# EAGLE schematic sd2snes17 (EAGLE 4.15)

## Sheet 1 of 4
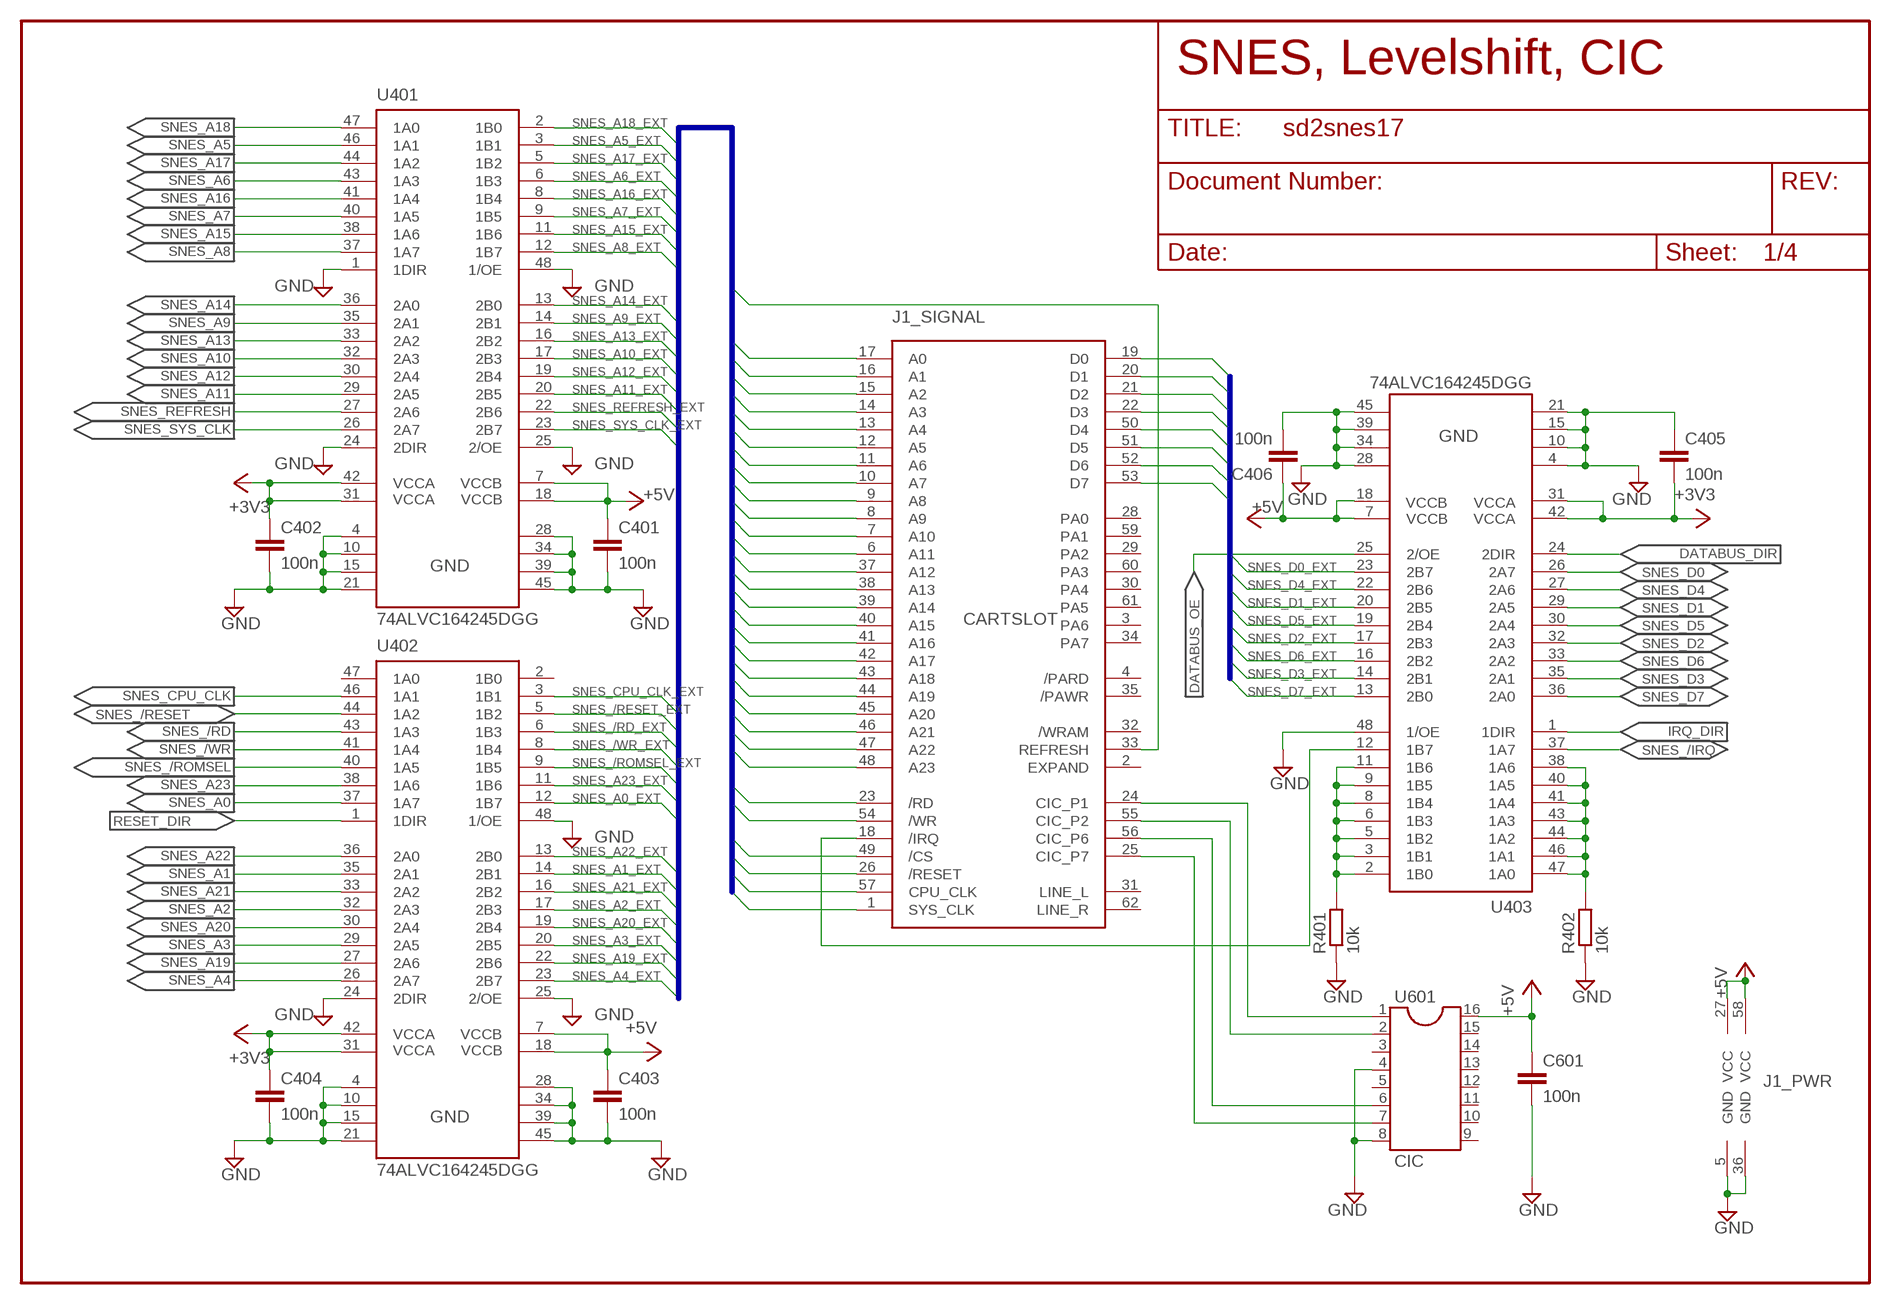
[diagram p0: schematic, sheet 1]

### Parts
C401  100n  C-EUC0805  [C0805]
C402  100n  C-EUC0805  [C0805]
C403  100n  C-EUC0805  [C0805]
C404  100n  C-EUC0805  [C0805]
C405  100n  C-EUC0805  [C0805]
C406  100n  C-EUC0805  [C0805]
C601  100n  C-EUC0805  [C0805]
J1  CARTSLOT  SNESCARTEDGE  [SNESCART]
R401  10k  R-EU_R0805  [R0805]
R402  10k  R-EU_R0805  [R0805]
U401  74ALVC164245DGG  [TSSOP48]
U402  74ALVC164245DGG  [TSSOP48]
U403  74ALVC164245DGG  [TSSOP48]
U601  CIC  DIL16S  [SOCKED-16]

### Nets
+3V3: C402.1 C404.1 C405.2 U401.31(VCCA1) U401.42(VCCA) U402.31(VCCA1) U402.42(VCCA) U403.31(VCCA1) U403.42(VCCA) ; also sheet 2,3,4
+5V: C401.1 C403.1 C406.1 C601.1 J1.27(_PWR:VCC) J1.58(_PWR:VCC) U401.7(VCCB) U401.18(VCCB1) U402.7(VCCB) U402.18(VCCB1) U403.7(VCCB) U403.18(VCCB1) U601.16 ; also sheet 4
GND: C401.2 C402.2 C403.2 C404.2 C405.1 C406.2 C601.2 J1.5(_PWR:GND) J1.36(_PWR:GND) R401.1 R402.1 U401.1(1DIR) U401.4(GND) U401.10(GND) U401.15(GND) U401.21(GND) U401.24(2DIR) U401.25(2/OE) U401.28(GND) U401.34(GND) U401.39(GND) U401.45(GND) U401.48(1/OE) U402.4(GND) U402.10(GND) U402.15(GND) U402.21(GND) U402.24(2DIR) U402.25(2/OE) U402.28(GND) U402.34(GND) U402.39(GND) U402.45(GND) U402.48(1/OE) U403.4(GND) U403.10(GND) U403.15(GND) U403.21(GND) U403.28(GND) U403.34(GND) U403.39(GND) U403.45(GND) U403.48(1/OE) U601.4 U601.8 ; also sheet 2,3,4
IRQ_DIR: U403.1(1DIR) ; also sheet 2
N$1: J1.24(_SIGNAL:CIC_P1) U601.1
N$2: J1.55(_SIGNAL:CIC_P2) U601.2
N$3: J1.56(_SIGNAL:CIC_P6) U601.6
N$4: J1.25(_SIGNAL:CIC_P7) U601.7
N$10: R401.2 U403.2(1B0) U403.3(1B1) U403.5(1B2) U403.6(1B3) U403.8(1B4) U403.9(1B5) U403.11(1B6)
N$12: R402.2 U403.38(1A6) U403.40(1A5) U403.41(1A4) U403.43(1A3) U403.44(1A2) U403.46(1A1) U403.47(1A0)
RESET_DIR: U402.1(1DIR) ; also sheet 4
SNES_/IRQ: U403.37(1A7) ; also sheet 2
SNES_/IRQ_EXT: J1.18(_SIGNAL:/IRQ) U403.12(1B7)
SNES_/RD: U402.43(1A3) ; also sheet 2
SNES_/RD_EXT: J1.23(_SIGNAL:/RD) U402.6(1B3)
SNES_/RESET: U402.44(1A2) ; also sheet 4
SNES_/RESET_EXT: J1.26(_SIGNAL:/RESET) U402.5(1B2)
SNES_/ROMSEL: U402.40(1A5) ; also sheet 2
SNES_/ROMSEL_EXT: J1.49(_SIGNAL:/CS) U402.9(1B5)
SNES_/WR: U402.41(1A4) ; also sheet 2
SNES_/WR_EXT: J1.54(_SIGNAL:/WR) U402.8(1B4)
SNES_A0: U402.37(1A7) ; also sheet 2
SNES_A0_EXT: J1.17(_SIGNAL:A0) U402.12(1B7)
SNES_A1: U402.35(2A1) ; also sheet 2
SNES_A1_EXT: J1.16(_SIGNAL:A1) U402.14(2B1)
SNES_A2: U402.32(2A3) ; also sheet 2
SNES_A2_EXT: J1.15(_SIGNAL:A2) U402.17(2B3)
SNES_A3: U402.29(2A5) ; also sheet 2
SNES_A3_EXT: J1.14(_SIGNAL:A3) U402.20(2B5)
SNES_A4: U402.26(2A7) ; also sheet 2
SNES_A4_EXT: J1.13(_SIGNAL:A4) U402.23(2B7)
SNES_A5: U401.46(1A1) ; also sheet 2
SNES_A5_EXT: J1.12(_SIGNAL:A5) U401.3(1B1)
SNES_A6: U401.43(1A3) ; also sheet 2
SNES_A6_EXT: J1.11(_SIGNAL:A6) U401.6(1B3)
SNES_A7: U401.40(1A5) ; also sheet 2
SNES_A7_EXT: J1.10(_SIGNAL:A7) U401.9(1B5)
SNES_A8: U401.37(1A7) ; also sheet 2
SNES_A8_EXT: J1.9(_SIGNAL:A8) U401.12(1B7)
SNES_A9: U401.35(2A1) ; also sheet 2
SNES_A9_EXT: J1.8(_SIGNAL:A9) U401.14(2B1)
SNES_A10: U401.32(2A3) ; also sheet 2
SNES_A10_EXT: J1.7(_SIGNAL:A10) U401.17(2B3)
SNES_A11: U401.29(2A5) ; also sheet 2
SNES_A11_EXT: J1.6(_SIGNAL:A11) U401.20(2B5)
SNES_A12: U401.30(2A4) ; also sheet 2
SNES_A12_EXT: J1.37(_SIGNAL:A12) U401.19(2B4)
SNES_A13: U401.33(2A2) ; also sheet 2
SNES_A13_EXT: J1.38(_SIGNAL:A13) U401.16(2B2)
SNES_A14: U401.36(2A0) ; also sheet 2
SNES_A14_EXT: J1.39(_SIGNAL:A14) U401.13(2B0)
SNES_A15: U401.38(1A6) ; also sheet 2
SNES_A15_EXT: J1.40(_SIGNAL:A15) U401.11(1B6)
SNES_A16: U401.41(1A4) ; also sheet 2
SNES_A16_EXT: J1.41(_SIGNAL:A16) U401.8(1B4)
SNES_A17: U401.44(1A2) ; also sheet 2
SNES_A17_EXT: J1.42(_SIGNAL:A17) U401.5(1B2)
SNES_A18: U401.47(1A0) ; also sheet 2
SNES_A18_EXT: J1.43(_SIGNAL:A18) U401.2(1B0)
SNES_A19: U402.27(2A6) ; also sheet 2
SNES_A19_EXT: J1.44(_SIGNAL:A19) U402.22(2B6)
SNES_A20: U402.30(2A4) ; also sheet 2
SNES_A20_EXT: J1.45(_SIGNAL:A20) U402.19(2B4)
SNES_A21: U402.33(2A2) ; also sheet 2
SNES_A21_EXT: J1.46(_SIGNAL:A21) U402.16(2B2)
SNES_A22: U402.36(2A0) ; also sheet 2
SNES_A22_EXT: J1.47(_SIGNAL:A22) U402.13(2B0)
SNES_A23: U402.38(1A6) ; also sheet 2
SNES_A23_EXT: J1.48(_SIGNAL:A23) U402.11(1B6)
SNES_CPU_CLK: U402.46(1A1) ; also sheet 2
SNES_CPU_CLK_EXT: J1.57(_SIGNAL:CPU_CLK) U402.3(1B1)
SNES_D0: U403.26(2A7) ; also sheet 2
SNES_D0_EXT: J1.19(_SIGNAL:D0) U403.23(2B7)
SNES_D1: U403.29(2A5) ; also sheet 2
SNES_D1_EXT: J1.20(_SIGNAL:D1) U403.20(2B5)
SNES_D2: U403.32(2A3) ; also sheet 2
SNES_D2_EXT: J1.21(_SIGNAL:D2) U403.17(2B3)
SNES_D3: U403.35(2A1) ; also sheet 2
SNES_D3_EXT: J1.22(_SIGNAL:D3) U403.14(2B1)
SNES_D4: U403.27(2A6) ; also sheet 2
SNES_D4_EXT: J1.50(_SIGNAL:D4) U403.22(2B6)
SNES_D5: U403.30(2A4) ; also sheet 2
SNES_D5_EXT: J1.51(_SIGNAL:D5) U403.19(2B4)
SNES_D6: U403.33(2A2) ; also sheet 2
SNES_D6_EXT: J1.52(_SIGNAL:D6) U403.16(2B2)
SNES_D7: U403.36(2A0) ; also sheet 2
SNES_D7_EXT: J1.53(_SIGNAL:D7) U403.13(2B0)
SNES_DATABUS_/OE: U403.25(2/OE) ; also sheet 2
SNES_DATABUS_DIR: U403.24(2DIR) ; also sheet 2
SNES_REFRESH: U401.27(2A6) ; also sheet 2
SNES_REFRESH_EXT: J1.33(_SIGNAL:REFRESH) U401.22(2B6)
SNES_SYS_CLK: U401.26(2A7) ; also sheet 2
SNES_SYS_CLK_EXT: J1.1(_SIGNAL:SYS_CLK) U401.23(2B7)
Unconnected: J1.2(_SIGNAL:EXPAND) J1.3(_SIGNAL:PA6) J1.4(_SIGNAL:/PARD) J1.28(_SIGNAL:PA0) J1.29(_SIGNAL:PA2) J1.30(_SIGNAL:PA4) J1.31(_SIGNAL:LINE_L) J1.32(_SIGNAL:/WRAM) J1.34(_SIGNAL:PA7) J1.35(_SIGNAL:/PAWR) J1.59(_SIGNAL:PA1) J1.60(_SIGNAL:PA3) J1.61(_SIGNAL:PA5) J1.62(_SIGNAL:LINE_R) U402.2(1B0) U402.47(1A0) U601.3 U601.5 U601.9 U601.10 U601.11 U601.12 U601.13 U601.14 U601.15

### Buses
B$1
B$2

### Notes on the sheet
- SNES, Levelshift, CIC

## Sheet 2 of 4
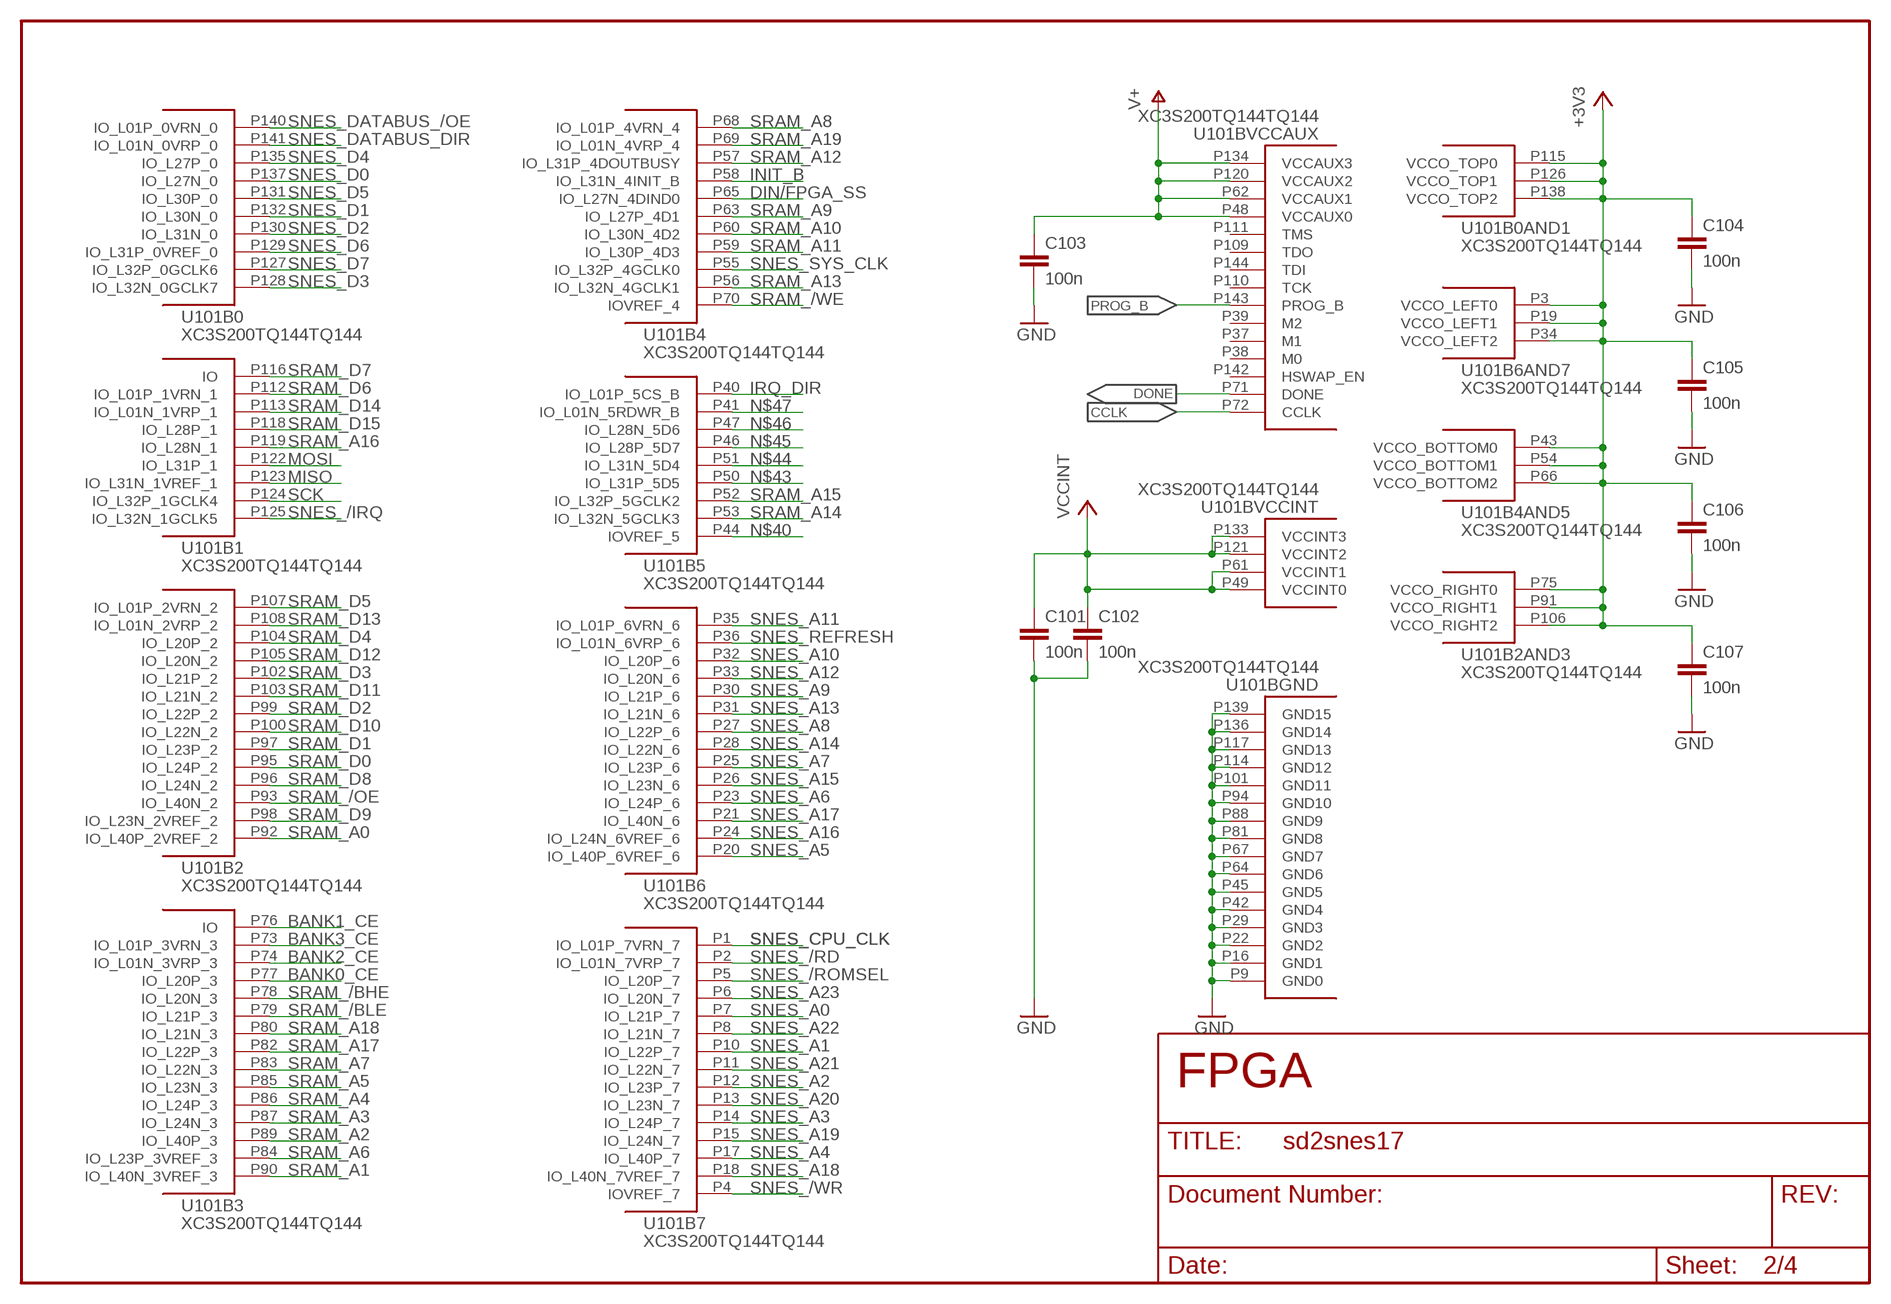
[diagram p1: schematic, sheet 2]

### Parts
C101  100n  C-EUC0805  [C0805]
C102  100n  C-EUC0805  [C0805]
C103  100n  C-EUC0805  [C0805]
C104  100n  C-EUC0805  [C0805]
C105  100n  C-EUC0805  [C0805]
C106  100n  C-EUC0805  [C0805]
C107  100n  C-EUC0805  [C0805]
U101  XC3S200TQ144TQ144  [TQ144]

### Nets
+1.25V: C101.1 C102.1 U101.P49(BVCCINT:VCCINT0) U101.P61(BVCCINT:VCCINT1) U101.P121(BVCCINT:VCCINT2) U101.P133(BVCCINT:VCCINT3) ; supply symbol labelled VCCINT ; also sheet 4
+2.5V: C103.1 U101.P48(BVCCAUX:VCCAUX0) U101.P62(BVCCAUX:VCCAUX1) U101.P120(BVCCAUX:VCCAUX2) U101.P134(BVCCAUX:VCCAUX3) ; supply symbol labelled V+ ; also sheet 4
+3V3: C104.1 C105.1 C106.1 C107.1 U101.P3(B6AND7:VCCO_LEFT0) U101.P19(B6AND7:VCCO_LEFT1) U101.P34(B6AND7:VCCO_LEFT2) U101.P43(B4AND5:VCCO_BOTTOM0) U101.P54(B4AND5:VCCO_BOTTOM1) U101.P66(B4AND5:VCCO_BOTTOM2) U101.P75(B2AND3:VCCO_RIGHT0) U101.P91(B2AND3:VCCO_RIGHT1) U101.P106(B2AND3:VCCO_RIGHT2) U101.P115(B0AND1:VCCO_TOP0) U101.P126(B0AND1:VCCO_TOP1) U101.P138(B0AND1:VCCO_TOP2) ; also sheet 1,3,4
BANK0_CE: U101.P77(B3:IO_L20P_3) ; also sheet 3
BANK1_CE: U101.P76(B3:IO) ; also sheet 3
BANK2_CE: U101.P74(B3:IO_L01N_3VRP_3) ; also sheet 3
BANK3_CE: U101.P73(B3:IO_L01P_3VRN_3) ; also sheet 3
CCLK: U101.P72(BVCCAUX:CCLK) ; also sheet 4
DIN/FPGA_SS: U101.P65(B4:IO_L27N_4DIND0) ; also sheet 4
DONE: U101.P71(BVCCAUX:DONE)
GND: C101.2 C102.2 C103.2 C104.2 C105.2 C106.2 C107.2 U101.P9(BGND:GND0) U101.P16(BGND:GND1) U101.P22(BGND:GND2) U101.P29(BGND:GND3) U101.P42(BGND:GND4) U101.P45(BGND:GND5) U101.P64(BGND:GND6) U101.P67(BGND:GND7) U101.P81(BGND:GND8) U101.P88(BGND:GND9) U101.P94(BGND:GND10) U101.P101(BGND:GND11) U101.P114(BGND:GND12) U101.P117(BGND:GND13) U101.P136(BGND:GND14) U101.P139(BGND:GND15) ; also sheet 1,3,4
INIT_B: U101.P58(B4:IO_L31N_4INIT_B) ; also sheet 4
IRQ_DIR: U101.P40(B5:IO_L01P_5CS_B) ; also sheet 1
MISO: U101.P123(B1:IO_L31N_1VREF_1) ; also sheet 4
MOSI: U101.P122(B1:IO_L31P_1) ; also sheet 4
N$40: U101.P44(B5:IOVREF_5)
N$43: U101.P50(B5:IO_L31P_5D5)
N$44: U101.P51(B5:IO_L31N_5D4)
N$45: U101.P46(B5:IO_L28P_5D7)
N$46: U101.P47(B5:IO_L28N_5D6)
N$47: U101.P41(B5:IO_L01N_5RDWR_B)
PROG_B: U101.P143(BVCCAUX:PROG_B) ; also sheet 4
SCK: U101.P124(B1:IO_L32P_1GCLK4) ; also sheet 4
SNES_/IRQ: U101.P125(B1:IO_L32N_1GCLK5) ; also sheet 1
SNES_/RD: U101.P2(B7:IO_L01N_7VRP_7) ; also sheet 1
SNES_/ROMSEL: U101.P5(B7:IO_L20P_7) ; also sheet 1
SNES_/WR: U101.P4(B7:IOVREF_7) ; also sheet 1
SNES_A0: U101.P7(B7:IO_L21P_7) ; also sheet 1
SNES_A1: U101.P10(B7:IO_L22P_7) ; also sheet 1
SNES_A2: U101.P12(B7:IO_L23P_7) ; also sheet 1
SNES_A3: U101.P14(B7:IO_L24P_7) ; also sheet 1
SNES_A4: U101.P17(B7:IO_L40P_7) ; also sheet 1
SNES_A5: U101.P20(B6:IO_L40P_6VREF_6) ; also sheet 1
SNES_A6: U101.P23(B6:IO_L24P_6) ; also sheet 1
SNES_A7: U101.P25(B6:IO_L23P_6) ; also sheet 1
SNES_A8: U101.P27(B6:IO_L22P_6) ; also sheet 1
SNES_A9: U101.P30(B6:IO_L21P_6) ; also sheet 1
SNES_A10: U101.P32(B6:IO_L20P_6) ; also sheet 1
SNES_A11: U101.P35(B6:IO_L01P_6VRN_6) ; also sheet 1
SNES_A12: U101.P33(B6:IO_L20N_6) ; also sheet 1
SNES_A13: U101.P31(B6:IO_L21N_6) ; also sheet 1
SNES_A14: U101.P28(B6:IO_L22N_6) ; also sheet 1
SNES_A15: U101.P26(B6:IO_L23N_6) ; also sheet 1
SNES_A16: U101.P24(B6:IO_L24N_6VREF_6) ; also sheet 1
SNES_A17: U101.P21(B6:IO_L40N_6) ; also sheet 1
SNES_A18: U101.P18(B7:IO_L40N_7VREF_7) ; also sheet 1
SNES_A19: U101.P15(B7:IO_L24N_7) ; also sheet 1
SNES_A20: U101.P13(B7:IO_L23N_7) ; also sheet 1
SNES_A21: U101.P11(B7:IO_L22N_7) ; also sheet 1
SNES_A22: U101.P8(B7:IO_L21N_7) ; also sheet 1
SNES_A23: U101.P6(B7:IO_L20N_7) ; also sheet 1
SNES_CPU_CLK: U101.P1(B7:IO_L01P_7VRN_7) ; also sheet 1
SNES_D0: U101.P137(B0:IO_L27N_0) ; also sheet 1
SNES_D1: U101.P132(B0:IO_L30N_0) ; also sheet 1
SNES_D2: U101.P130(B0:IO_L31N_0) ; also sheet 1
SNES_D3: U101.P128(B0:IO_L32N_0GCLK7) ; also sheet 1
SNES_D4: U101.P135(B0:IO_L27P_0) ; also sheet 1
SNES_D5: U101.P131(B0:IO_L30P_0) ; also sheet 1
SNES_D6: U101.P129(B0:IO_L31P_0VREF_0) ; also sheet 1
SNES_D7: U101.P127(B0:IO_L32P_0GCLK6) ; also sheet 1
SNES_DATABUS_/OE: U101.P140(B0:IO_L01P_0VRN_0) ; also sheet 1
SNES_DATABUS_DIR: U101.P141(B0:IO_L01N_0VRP_0) ; also sheet 1
SNES_REFRESH: U101.P36(B6:IO_L01N_6VRP_6) ; also sheet 1
SNES_SYS_CLK: U101.P55(B4:IO_L32P_4GCLK0) ; also sheet 1
SRAM_/BHE: U101.P78(B3:IO_L20N_3) ; also sheet 3
SRAM_/BLE: U101.P79(B3:IO_L21P_3) ; also sheet 3
SRAM_/OE: U101.P93(B2:IO_L40N_2) ; also sheet 3
SRAM_/WE: U101.P70(B4:IOVREF_4) ; also sheet 3
SRAM_A0: U101.P92(B2:IO_L40P_2VREF_2) ; also sheet 3
SRAM_A1: U101.P90(B3:IO_L40N_3VREF_3) ; also sheet 3
SRAM_A2: U101.P89(B3:IO_L40P_3) ; also sheet 3
SRAM_A3: U101.P87(B3:IO_L24N_3) ; also sheet 3
SRAM_A4: U101.P86(B3:IO_L24P_3) ; also sheet 3
SRAM_A5: U101.P85(B3:IO_L23N_3) ; also sheet 3
SRAM_A6: U101.P84(B3:IO_L23P_3VREF_3) ; also sheet 3
SRAM_A7: U101.P83(B3:IO_L22N_3) ; also sheet 3
SRAM_A8: U101.P68(B4:IO_L01P_4VRN_4) ; also sheet 3
SRAM_A9: U101.P63(B4:IO_L27P_4D1) ; also sheet 3
SRAM_A10: U101.P60(B4:IO_L30N_4D2) ; also sheet 3
SRAM_A11: U101.P59(B4:IO_L30P_4D3) ; also sheet 3
SRAM_A12: U101.P57(B4:IO_L31P_4DOUTBUSY) ; also sheet 3
SRAM_A13: U101.P56(B4:IO_L32N_4GCLK1) ; also sheet 3
SRAM_A14: U101.P53(B5:IO_L32N_5GCLK3) ; also sheet 3
SRAM_A15: U101.P52(B5:IO_L32P_5GCLK2) ; also sheet 3
SRAM_A16: U101.P119(B1:IO_L28N_1) ; also sheet 3
SRAM_A17: U101.P82(B3:IO_L22P_3) ; also sheet 3
SRAM_A18: U101.P80(B3:IO_L21N_3) ; also sheet 3
SRAM_A19: U101.P69(B4:IO_L01N_4VRP_4) ; also sheet 3
SRAM_D0: U101.P95(B2:IO_L24P_2) ; also sheet 3
SRAM_D1: U101.P97(B2:IO_L23P_2) ; also sheet 3
SRAM_D2: U101.P99(B2:IO_L22P_2) ; also sheet 3
SRAM_D3: U101.P102(B2:IO_L21P_2) ; also sheet 3
SRAM_D4: U101.P104(B2:IO_L20P_2) ; also sheet 3
SRAM_D5: U101.P107(B2:IO_L01P_2VRN_2) ; also sheet 3
SRAM_D6: U101.P112(B1:IO_L01P_1VRN_1) ; also sheet 3
SRAM_D7: U101.P116(B1:IO) ; also sheet 3
SRAM_D8: U101.P96(B2:IO_L24N_2) ; also sheet 3
SRAM_D9: U101.P98(B2:IO_L23N_2VREF_2) ; also sheet 3
SRAM_D10: U101.P100(B2:IO_L22N_2) ; also sheet 3
SRAM_D11: U101.P103(B2:IO_L21N_2) ; also sheet 3
SRAM_D12: U101.P105(B2:IO_L20N_2) ; also sheet 3
SRAM_D13: U101.P108(B2:IO_L01N_2VRP_2) ; also sheet 3
SRAM_D14: U101.P113(B1:IO_L01N_1VRP_1) ; also sheet 3
SRAM_D15: U101.P118(B1:IO_L28P_1) ; also sheet 3
Unconnected: U101.P37(BVCCAUX:M1) U101.P38(BVCCAUX:M0) U101.P39(BVCCAUX:M2) U101.P109(BVCCAUX:TDO) U101.P110(BVCCAUX:TCK) U101.P111(BVCCAUX:TMS) U101.P142(BVCCAUX:HSWAP_EN) U101.P144(BVCCAUX:TDI)

### Notes on the sheet
- FPGA

## Sheet 3 of 4
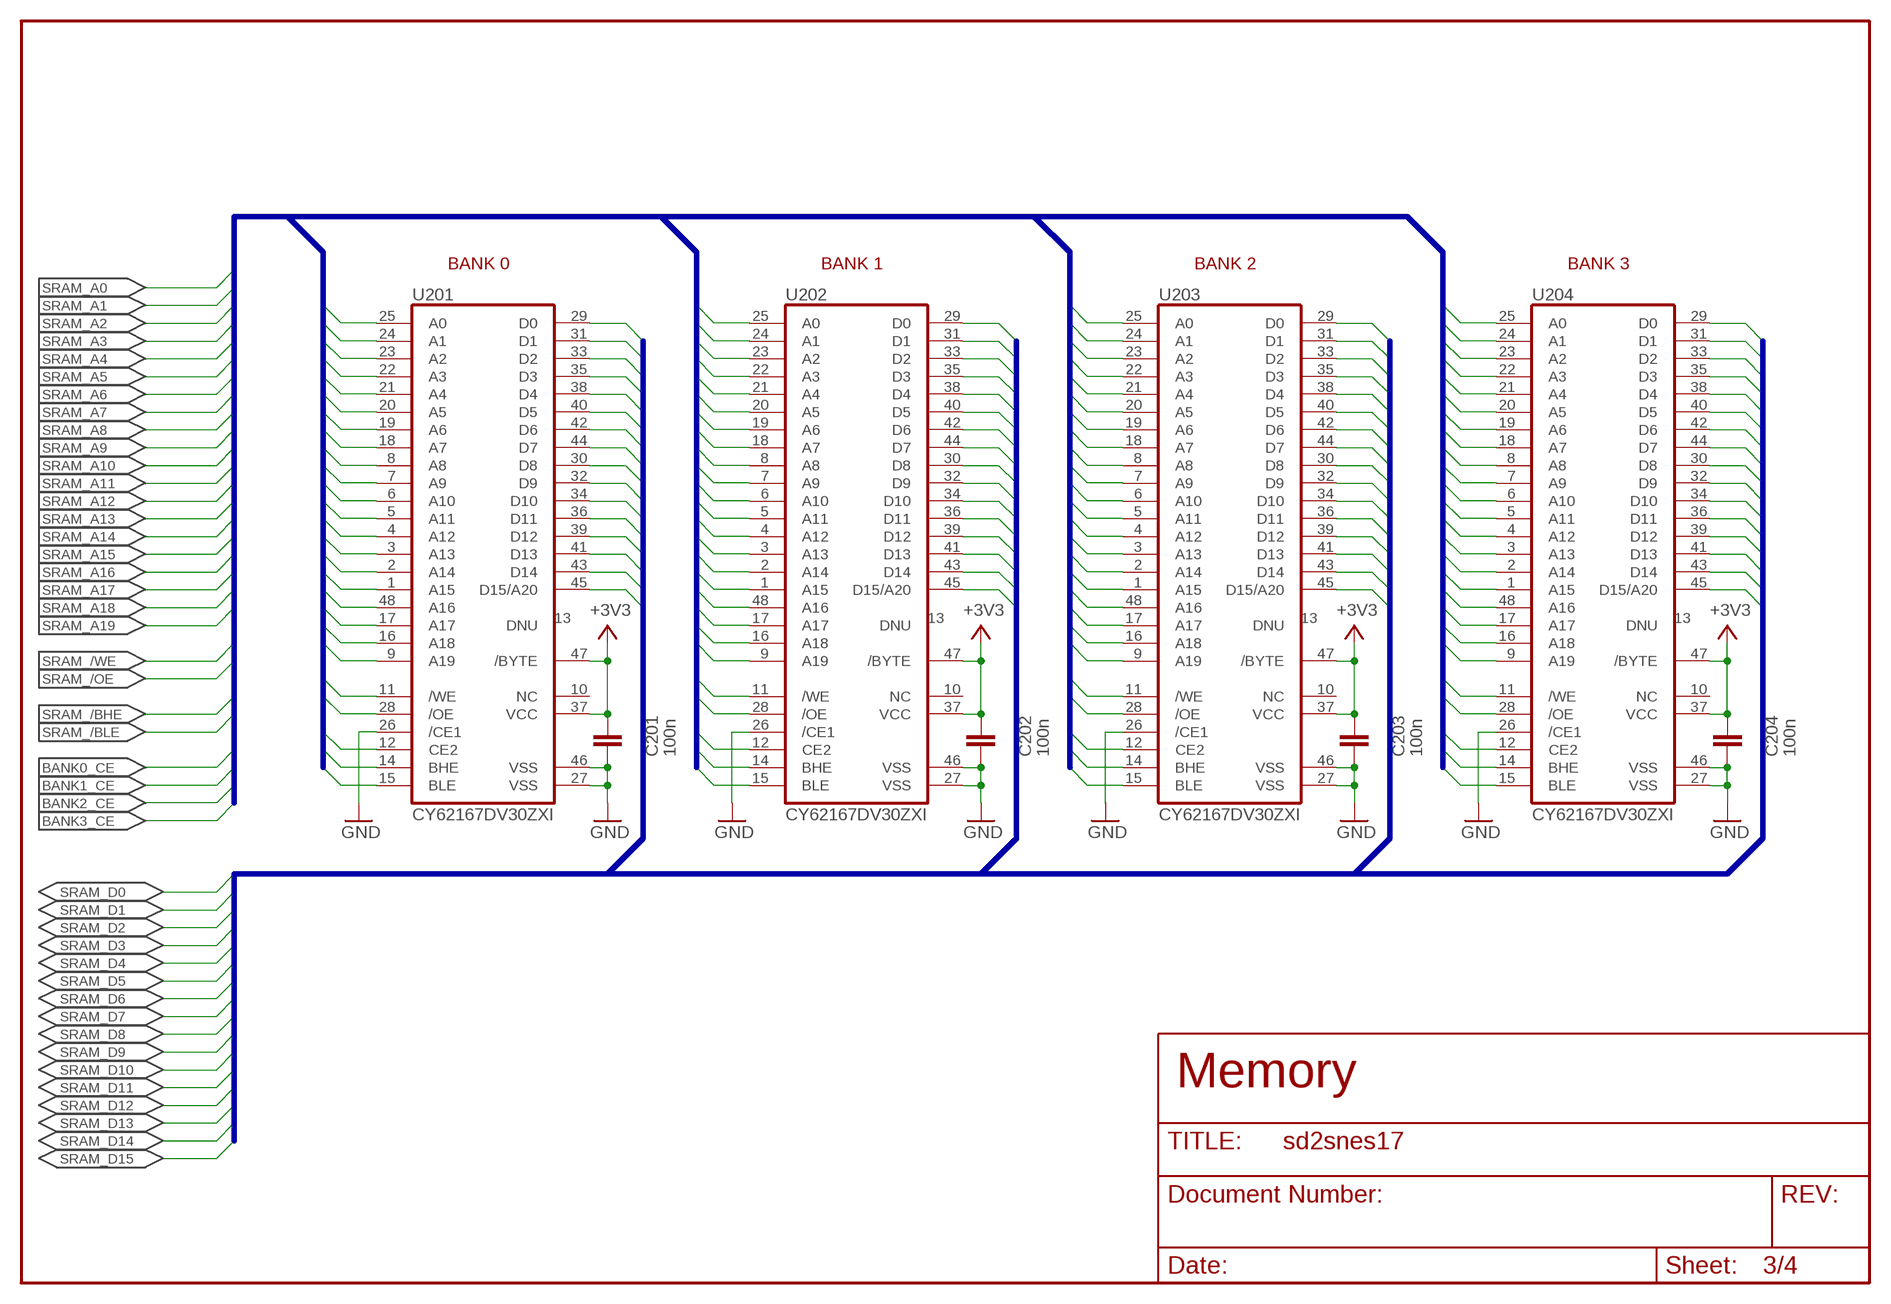
[diagram p2: schematic, sheet 3]

### Parts
C201  100n  C-EUC0805  [C0805]
C202  100n  C-EUC0805  [C0805]
C203  100n  C-EUC0805  [C0805]
C204  100n  C-EUC0805  [C0805]
U201  CY62167DV30ZXI  [TSOP48]
U202  CY62167DV30ZXI  [TSOP48]
U203  CY62167DV30ZXI  [TSOP48]
U204  CY62167DV30ZXI  [TSOP48]

### Nets
+3V3: C201.1 C202.1 C203.1 C204.1 U201.37(VCC) U201.47(/BYTE) U202.37(VCC) U202.47(/BYTE) U203.37(VCC) U203.47(/BYTE) U204.37(VCC) U204.47(/BYTE) ; also sheet 1,2,4
BANK0_CE: U201.12(CE2) ; also sheet 2
BANK1_CE: U202.12(CE2) ; also sheet 2
BANK2_CE: U203.12(CE2) ; also sheet 2
BANK3_CE: U204.12(CE2) ; also sheet 2
GND: C201.2 C202.2 C203.2 C204.2 U201.26(/CE1) U201.27(VSS) U201.46(VSS) U202.26(/CE1) U202.27(VSS) U202.46(VSS) U203.26(/CE1) U203.27(VSS) U203.46(VSS) U204.26(/CE1) U204.27(VSS) U204.46(VSS) ; also sheet 1,2,4
SRAM_/BHE: U201.14(BHE) U202.14(BHE) U203.14(BHE) U204.14(BHE) ; also sheet 2
SRAM_/BLE: U201.15(BLE) U202.15(BLE) U203.15(BLE) U204.15(BLE) ; also sheet 2
SRAM_/OE: U201.28(/OE) U202.28(/OE) U203.28(/OE) U204.28(/OE) ; also sheet 2
SRAM_/WE: U201.11(/WE) U202.11(/WE) U203.11(/WE) U204.11(/WE) ; also sheet 2
SRAM_A0: U201.25(A0) U202.25(A0) U203.25(A0) U204.25(A0) ; also sheet 2
SRAM_A1: U201.24(A1) U202.24(A1) U203.24(A1) U204.24(A1) ; also sheet 2
SRAM_A2: U201.23(A2) U202.23(A2) U203.23(A2) U204.23(A2) ; also sheet 2
SRAM_A3: U201.22(A3) U202.22(A3) U203.22(A3) U204.22(A3) ; also sheet 2
SRAM_A4: U201.21(A4) U202.21(A4) U203.21(A4) U204.21(A4) ; also sheet 2
SRAM_A5: U201.20(A5) U202.20(A5) U203.20(A5) U204.20(A5) ; also sheet 2
SRAM_A6: U201.19(A6) U202.19(A6) U203.19(A6) U204.19(A6) ; also sheet 2
SRAM_A7: U201.18(A7) U202.18(A7) U203.18(A7) U204.18(A7) ; also sheet 2
SRAM_A8: U201.8(A8) U202.8(A8) U203.8(A8) U204.8(A8) ; also sheet 2
SRAM_A9: U201.7(A9) U202.7(A9) U203.7(A9) U204.7(A9) ; also sheet 2
SRAM_A10: U201.6(A10) U202.6(A10) U203.6(A10) U204.6(A10) ; also sheet 2
SRAM_A11: U201.5(A11) U202.5(A11) U203.5(A11) U204.5(A11) ; also sheet 2
SRAM_A12: U201.4(A12) U202.4(A12) U203.4(A12) U204.4(A12) ; also sheet 2
SRAM_A13: U201.3(A13) U202.3(A13) U203.3(A13) U204.3(A13) ; also sheet 2
SRAM_A14: U201.2(A14) U202.2(A14) U203.2(A14) U204.2(A14) ; also sheet 2
SRAM_A15: U201.1(A15) U202.1(A15) U203.1(A15) U204.1(A15) ; also sheet 2
SRAM_A16: U201.48(A16) U202.48(A16) U203.48(A16) U204.48(A16) ; also sheet 2
SRAM_A17: U201.17(A17) U202.17(A17) U203.17(A17) U204.17(A17) ; also sheet 2
SRAM_A18: U201.16(A18) U202.16(A18) U203.16(A18) U204.16(A18) ; also sheet 2
SRAM_A19: U201.9(A19) U202.9(A19) U203.9(A19) U204.9(A19) ; also sheet 2
SRAM_D0: U201.29(D0) U202.29(D0) U203.29(D0) U204.29(D0) ; also sheet 2
SRAM_D1: U201.31(D1) U202.31(D1) U203.31(D1) U204.31(D1) ; also sheet 2
SRAM_D2: U201.33(D2) U202.33(D2) U203.33(D2) U204.33(D2) ; also sheet 2
SRAM_D3: U201.35(D3) U202.35(D3) U203.35(D3) U204.35(D3) ; also sheet 2
SRAM_D4: U201.38(D4) U202.38(D4) U203.38(D4) U204.38(D4) ; also sheet 2
SRAM_D5: U201.40(D5) U202.40(D5) U203.40(D5) U204.40(D5) ; also sheet 2
SRAM_D6: U201.42(D6) U202.42(D6) U203.42(D6) U204.42(D6) ; also sheet 2
SRAM_D7: U201.44(D7) U202.44(D7) U203.44(D7) U204.44(D7) ; also sheet 2
SRAM_D8: U201.30(D8) U202.30(D8) U203.30(D8) U204.30(D8) ; also sheet 2
SRAM_D9: U201.32(D9) U202.32(D9) U203.32(D9) U204.32(D9) ; also sheet 2
SRAM_D10: U201.34(D10) U202.34(D10) U203.34(D10) U204.34(D10) ; also sheet 2
SRAM_D11: U201.36(D11) U202.36(D11) U203.36(D11) U204.36(D11) ; also sheet 2
SRAM_D12: U201.39(D12) U202.39(D12) U203.39(D12) U204.39(D12) ; also sheet 2
SRAM_D13: U201.41(D13) U202.41(D13) U203.41(D13) U204.41(D13) ; also sheet 2
SRAM_D14: U201.43(D14) U202.43(D14) U203.43(D14) U204.43(D14) ; also sheet 2
SRAM_D15: U201.45(D15/A20) U202.45(D15/A20) U203.45(D15/A20) U204.45(D15/A20) ; also sheet 2
Unconnected: U201.10(NC) U201.13(DNU) U202.10(NC) U202.13(DNU) U203.10(NC) U203.13(DNU) U204.10(NC) U204.13(DNU)

### Buses
B$3
B$4

### Notes on the sheet
- BANK 0 | BANK 1 | BANK 2 | BANK 3
- Memory

## Sheet 4 of 4
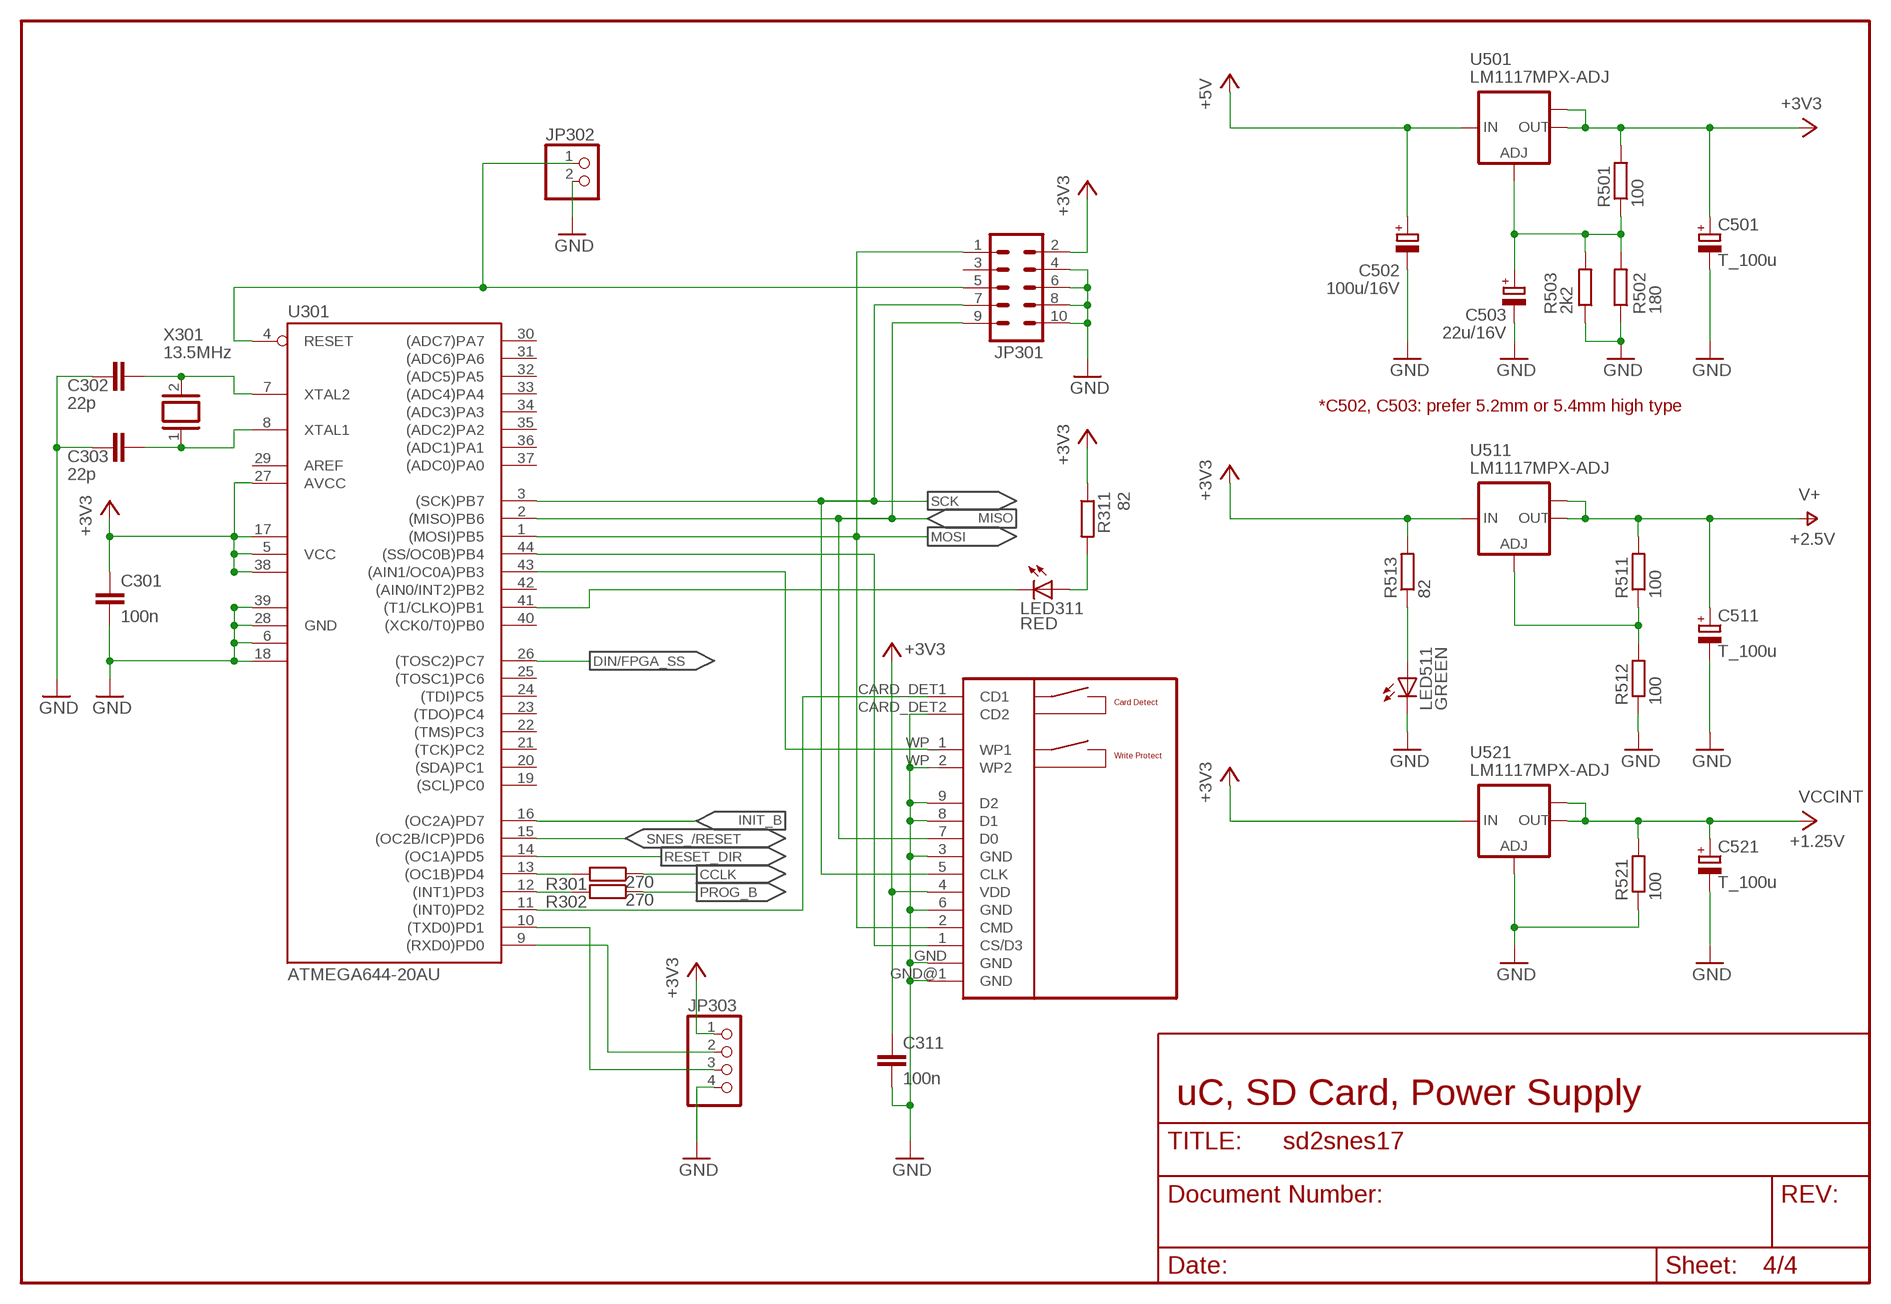
[diagram p3: schematic, sheet 4]

### Parts
C301  100n  C-EUC0805  [C0805]
C302  22p  C-EUC0805  [C0805]
C303  22p  C-EUC0805  [C0805]
C311  100n  C-EUC0805  [C0805]
C501  T_100u  CPOL-EUSMCD  [SMC_D]
C502  100u/16V  CPOL-EUD  [PANASONIC_D]
C503  22u/16V  CPOL-EUB  [PANASONIC_B]
C511  T_100u  CPOL-EUSMCD  [SMC_D]
C521  T_100u  CPOL-EUSMCD  [SMC_D]
J301  JAE-SG5S009V1A  [JAE-SG5S009V1A]
JP301  MA05-2  [MA05-2]
JP302  PINHD-1X2  [1X02]
JP303  PINHD-1X4  [1X04]
LED311  RED  LEDCHIPLED_0805  [CHIPLED_0805]
LED511  GREEN  LEDCHIPLED_0805  [CHIPLED_0805]
R301  270  R-EU_R0805  [R0805]
R302  270  R-EU_R0805  [R0805]
R311  82  R-EU_R0805  [R0805]
R501  100  R-EU_R0805  [R0805]
R502  180  R-EU_R0805  [R0805]
R503  2k2  R-EU_R0805  [R0805]
R511  100  R-EU_R0805  [R0805]
R512  100  R-EU_R0805  [R0805]
R513  82  R-EU_R0805  [R0805]
R521  100  R-EU_R0805  [R0805]
U301  ATMEGA644-20AU  [TQFP44]
U501  LM1117MPX-ADJ  [SOT223]
U511  LM1117MPX-ADJ  [SOT223]
U521  LM1117MPX-ADJ  [SOT223]
X301  13.5MHz  XTAL/S  [QS]

### Nets
+1.25V: C521.+ R521.2 U521.2(OUT) U521.TAB(OUT1) ; supply symbol labelled VCCINT ; also sheet 2
+2.5V: C511.+ R511.2 U511.2(OUT) U511.TAB(OUT1) ; supply symbol labelled V+ ; also sheet 2
+3V3: C301.1 C311.1 C501.+ J301.4(VDD) JP301.2 JP303.1 R311.1 R501.2 R513.2 U301.5(VCC) U301.17(VCC1) U301.27(AVCC) U301.38(VCC2) U501.2(OUT) U501.TAB(OUT1) U511.3(IN) U521.3(IN) ; also sheet 1,2,3
+5V: C502.+ U501.3(IN) ; also sheet 1
CCLK: R301.1 ; also sheet 2
CCLK_AVR: R301.2 U301.13((OC1B)PD4)
DIN/FPGA_SS: U301.26((TOSC2)PC7) ; also sheet 2
GND: C301.2 C302.1 C303.1 C311.2 C501.- C502.- C503.- C511.- C521.- J301.3(GND) J301.6(GND) J301.8(D1) J301.9(D2) J301.CARD_DET2(CD2) J301.GND J301.GND@1(GND) J301.WP_2(WP2) JP301.4 JP301.6 JP301.8 JP301.10 JP302.2 JP303.4 LED511.C R502.1 R503.1 R512.1 R521.1 U301.6(GND2) U301.18(GND3) U301.28(GND) U301.39(GND1) U521.1(ADJ) ; also sheet 1,2,3
INIT_B: U301.16((OC2A)PD7) ; also sheet 2
MISO: J301.7(D0) JP301.9 U301.2((MISO)PB6) ; also sheet 2
MOSI: J301.2(CMD) JP301.1 U301.1((MOSI)PB5) ; also sheet 2
N$5: C302.2 U301.7(XTAL2) X301.2
N$6: C303.2 U301.8(XTAL1) X301.1
N$7: LED311.A R311.2
N$8: JP301.5 JP302.1 U301.4(RESET)
N$9: LED511.A R513.1
N$11: LED311.C U301.41((T1/CLKO)PB1)
N$107: R511.1 R512.2 U511.1(ADJ)
N$108: C503.+ R501.1 R502.2 R503.2 U501.1(ADJ)
PROG_B: R302.1 ; also sheet 2
PROG_B_AVR: R302.2 U301.12((INT1)PD3)
RESET_DIR: U301.14((OC1A)PD5) ; also sheet 1
RXD: JP303.2 U301.9((RXD0)PD0)
SCK: J301.5(CLK) JP301.7 U301.3((SCK)PB7) ; also sheet 2
SD_DET: J301.CARD_DET1(CD1) U301.11((INT0)PD2)
SD_SS: J301.1(CS/D3) U301.44((SS/OC0B)PB4)
SD_WP: J301.WP_1(WP1) U301.43((AIN1/OC0A)PB3)
SNES_/RESET: U301.15((OC2B/ICP)PD6) ; also sheet 1
TXD: JP303.3 U301.10((TXD0)PD1)
Unconnected: JP301.3 U301.19((SCL)PC0) U301.20((SDA)PC1) U301.21((TCK)PC2) U301.22((TMS)PC3) U301.23((TDO)PC4) U301.24((TDI)PC5) U301.25((TOSC1)PC6) U301.30((ADC7)PA7) U301.31((ADC6)PA6) U301.32((ADC5)PA5) U301.33((ADC4)PA4) U301.34((ADC3)PA3) U301.35((ADC2)PA2) U301.36((ADC1)PA1) U301.37((ADC0)PA0) U301.40((XCK0/T0)PB0) U301.42((AIN0/INT2)PB2)

### Notes on the sheet
- *C502, C503: prefer 5.2mm or 5.4mm high type
- uC, SD Card, Power Supply

## Power pins joined to a net without a drawn wire
AREF: U301.29(AREF)

## Library data of the parts
C101-C107 C201-C204 C301-C303 C311 C401-C406 C601 = rcl:C-EU: CAPACITOR, European symbol
C501-C503 C511 C521 = rcl:CPOL-EU: POLARIZED CAPACITOR, European symbol
J1 = snescart:SNESCART
J301 = sdcard:JAE-SG5S009V1A
JP301 = con-lstb:MA05-2: PIN HEADER
JP302 = pinhead:PINHD-1X2: PIN HEADER
JP303 = pinhead:PINHD-1X4: PIN HEADER
LED311 LED511 = led:LED: LED OSRAM: - CHIPLED LG R971, LG N971, LY N971, LG Q971, LY Q971, LO R971, LY R971 LH N974, LH R974 LS Q976, LO Q976, LY Q976 LO Q996 - Hyper CHIPLED LW Q18S LB Q993, LB Q99A, LB R99A - SideLED LS A670, LO A670, LY A670, LG A670, LP A670 LB A673, LV A673, LT A673, LW A673 LH A674 LY A675 LS A676, LA A676, LO A676, LY A676, LW A676 LS A679, LY A679, LG A679 - Hyper Micro SIDELED® LS Y876, LA Y876, LO Y876, LY Y876 LT Y87S - SmartLED LW L88C, LW L88S LB L89C, LB L89S, LG L890 LS L89K, LO L89K, LY L89K LS L896, LA L896, LO L896, LY L896 - TOPLED LS T670, LO T670, LY T670, LG T670, LP T670 LSG T670, LSP T670, LSY T670, LOP T670, LYG T670 LG T671, LOG T671, LSG T671 LB T673, LV T673, LT T673, LW T673 LH T674 LS T676, LA T676, LO T676, LY T676, LB T676, LH T676, LSB T676, LW T676 LB T67C, LV T67C, LT T67C, LS T67K, LO T67K, LY T67K, LW E67C LS E67B, LA E67B, LO E67B, LY E67B, LB E67C, LV E67C, LT E67C LW T67C LS T679, LY T679, LG T679 LS T770, LO T770, LY T770, LG T770, LP T770 LB T773, LV T773, LT T773, LW T773 LH T774 LS E675, LA E675, LY E675, LS T675 LS T776, LA T776, LO T776, LY T776, LB T776 LHGB T686 LT T68C, LB T68C - Hyper Mini TOPLED® LB M676 - Mini TOPLED Santana® LG M470 LS M47K, LO M47K, LY M47K Source: http://www.osram.convergy.de/
R301 R302 R311 R401 R402 R501-R503 R511-R513 R521 = rcl:R-EU_: RESISTOR, European symbol
U101 = xilinx_spartan3_virtex4_and_5:XC3S200TQ144: Xilinx FPGA
U201-U204 = cy62167:CY62167DV30
U301 = atmega644:ATMEGA644-20AU
U401-U403 = misc-74:74ALVC164245
U501 U511 U521 = lm1117:LM1117MPX-ADJ
U601 = ic-package:DIL16: Dual In Line
X301 = special:XTAL/S: CRYSTAL